# EAGLE design MLX90614-IR v4 (EAGLE 6.6.0)
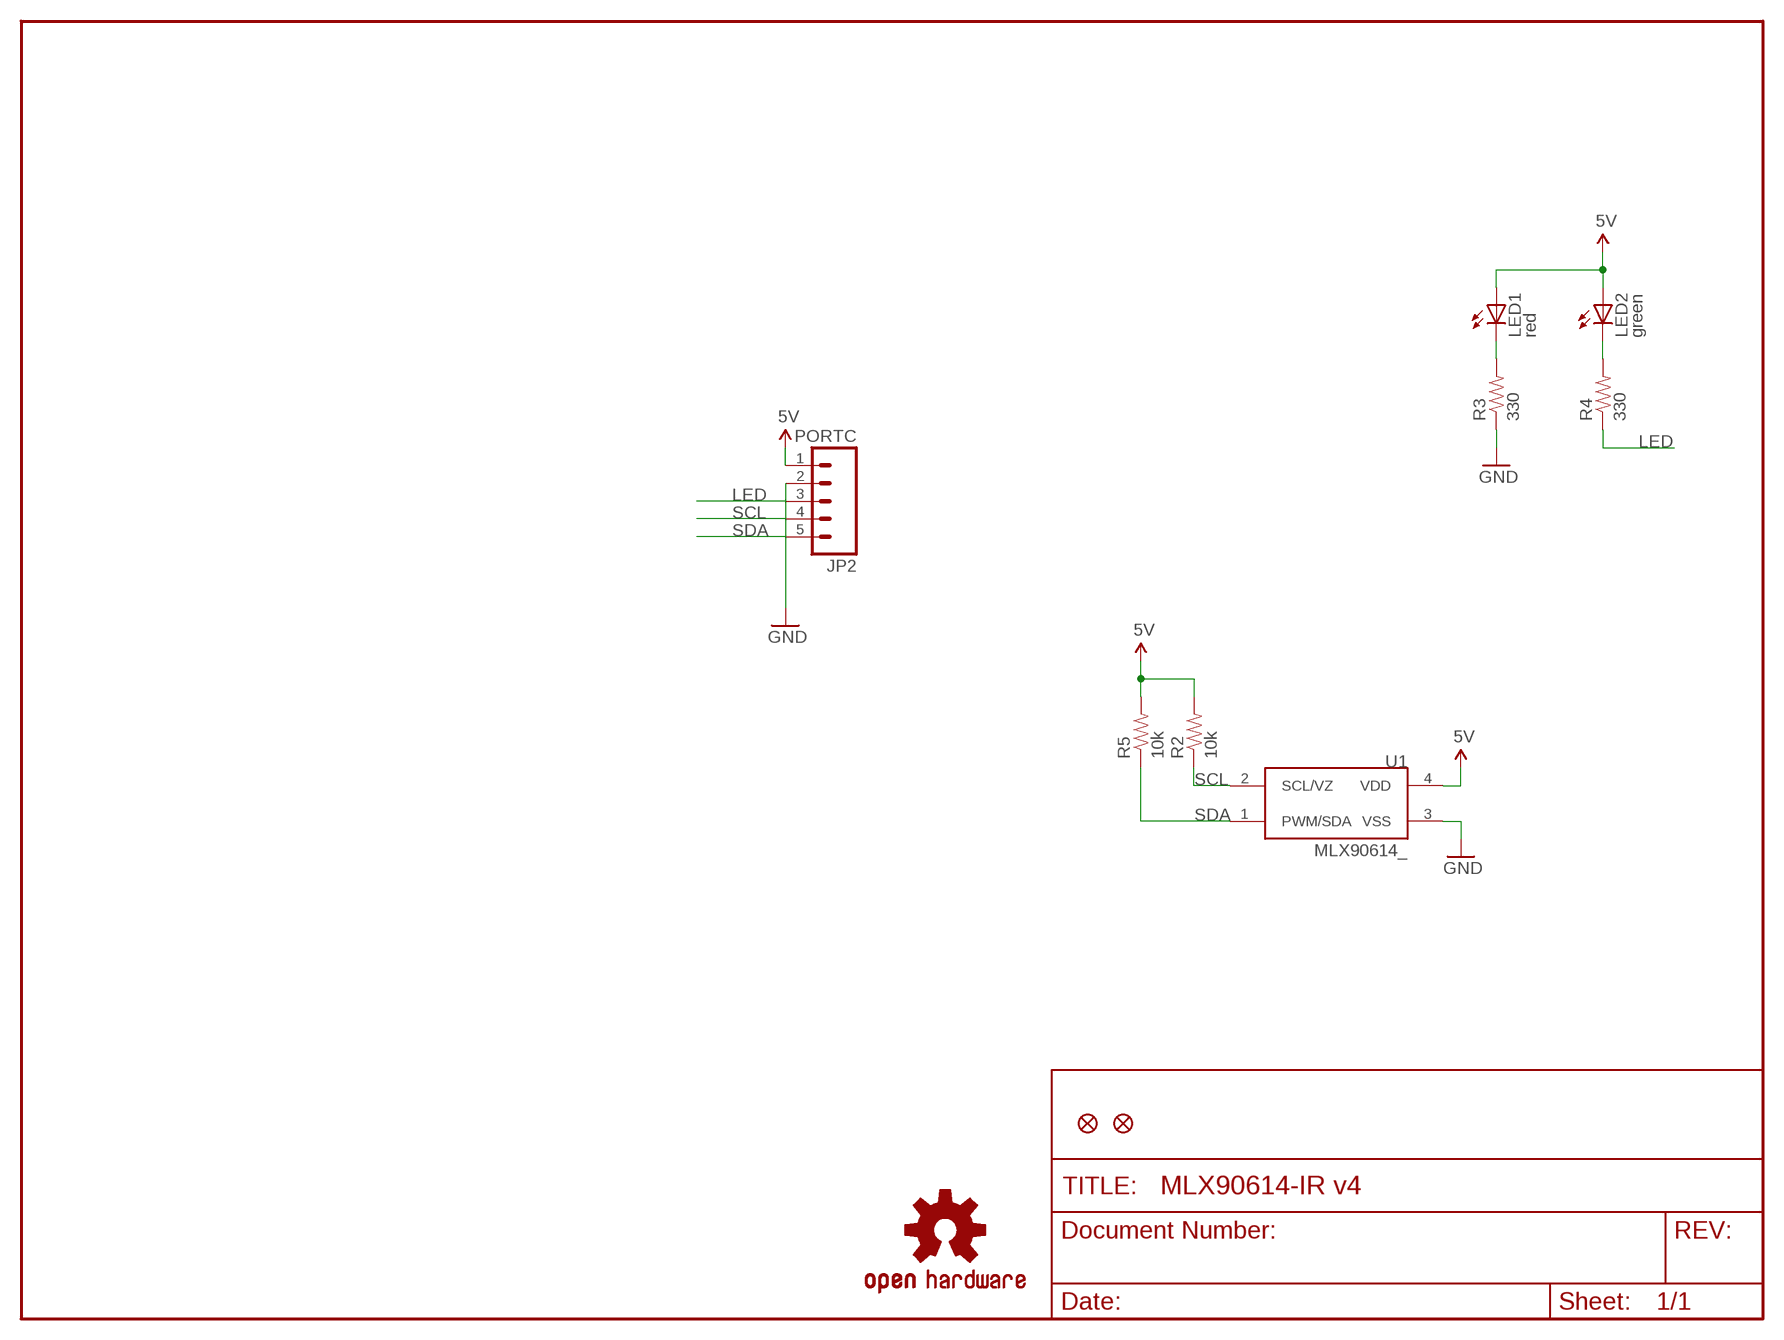
[diagram p0: schematic, sheet 1]

## Parts
JP2  PORTC  M05PTH  [1X05]
JP3  FIDUCIAL1X2.5  [FIDUCIAL-1X2.5]
JP5  FIDUCIAL1X2.5  [FIDUCIAL-1X2.5]
LED1  red  LED0603  [LED-0603]
LED2  green  LED0603  [LED-0603]
R2  10k  RESISTOR0402-RES  [0402-RES]
R3  330  RESISTOR0402-RES  [0402-RES]
R4  330  RESISTOR0402-RES  [0402-RES]
R5  10k  RESISTOR0402-RES  [0402-RES]
U1  MLX90614_  [TO-39]
U$1  OSHW-LOGOS  [OSHW-LOGO-S]

## Nets
5V: JP2.1 LED1.A LED2.A R2.2 R5.2 U1.4(VDD)
GND: JP2.2 R3.1 U1.3(VSS)
LED: JP2.3 R4.1
N$2: LED1.C R3.2
N$3: LED2.C R4.2
SCL: JP2.4 R2.1 U1.2(SCL/VZ)
SDA: JP2.5 R5.1 U1.1(PWM/SDA)

## Library data of the parts
JP2 = SparkFun-Connectors:M05: Header 5 Standard 5-pin 0.1" header. Use with straight break away headers (SKU : PRT-00116), right angle break away headers (PRT-00553), swiss pins (PRT-00743), machine pins (PRT-00117), and female headers (PRT-00115). Molex polarized connector foot print use with SKU : PRT-08230 with associated crimp pins and housings.
JP3 JP5 = abes:FIDUCIAL: Fiducial Alignment Points Various fiducial points for machine vision alignment.
LED1 LED2 = SparkFun:LED: LEDs Standard schematic elements and footprints for 5mm, 3mm, 1206, and 0603 sized LEDs. 5mm - Spark Fun Electronics SKU : COM-00529 (and others)
R2-R5 = SparkFun:RESISTOR: Resistor Basic schematic elements and footprints for 0603, 1206, and PTH 1/10th watt (small) resistors.
U1 = SparkFun-Sensors:MLX90614: Non-contact PIR I2C interface temperature sensor
U$1 = SparkFun:OSHW-LOGO: Open Source Hardware Logo This logo indicates the piece of hardware it is found on incorporates a OSHW license and/or adheres to the definition of open source hardware found here: http://freedomdefined.org/OSHW

## Net classes
0 default: width 0.406 mm, clearance 0.406 mm

## Board
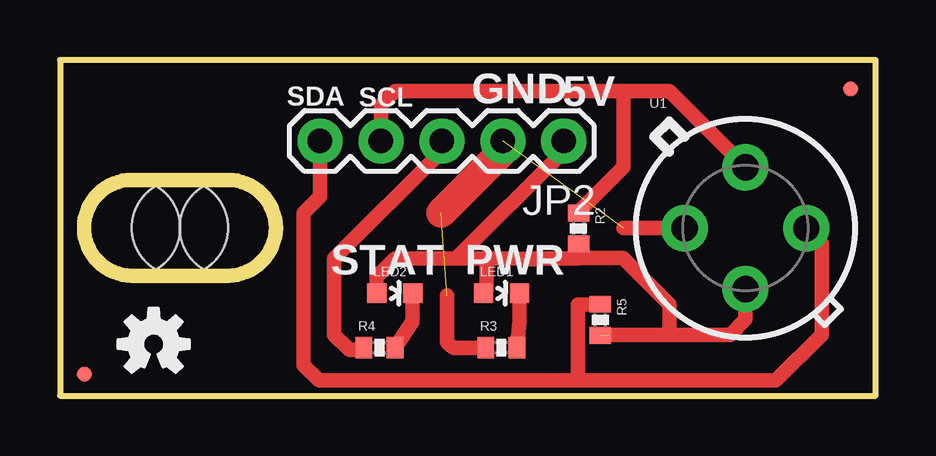
[diagram p1: board, top side]

Size 34 x 14 mm. Coordinates in mm from the lower left corner, seen from the top.
Outline: 0,0 34,0 34,14 0,14 0,0
Copper layers (1*16): Top 0.035mm / dielectric 1.5mm / Bottom 0.035mm
Design rules "SparkFun": minimum track width 8mil, minimum drill 20mil, track to track 8mil, track to pad 8mil, pad to pad 8mil, via to via 8mil, smd to smd 8mil, copper to edge 8mil, drill to drill 8mil, minimum pad ring 12mil, minimum via ring 10mil, stop-mask expansion 4mil, vias tented up to drill 20mil, thermal gap 10mil
Holes 4 mm at 5,7 7,7 3,7
Milling: 4 lines

### Footprints (pad centres in the part's own frame; a part is rotated, then mirrored left to right if it is on the bottom)
1X05 = drill 1.016 pad 1.88: 1 0,0; 2 2.54,0; 3 5.08,0; 4 7.62,0; 5 10.16,0
FIDUCIAL-1X2.5 = smd 0.635 x 0.635: 1 0,0
LED-0603 = smd 0.8 x 0.8: A 0,-0.75; C 0,0.75
0402-RES = smd 0.7 x 0.9: 1 -0.65,0; 2 0.65,0
TO-39 = drill 1.1 pad 1.93: 1 2.54,0; 2 0,2.54; 3 -2.54,0; 4 0,-2.54

### Placement (x,y rotation side)
JP2  21,10.62 180 top
JP3  1.02,0.9 0 top
JP5  32.96,12.8 0 top
LED1  18.4,4.27 270 top
LED2  13.96,4.27 270 top
R2  21.62,6.97 270 top
R3  18.4,2 0 top
R4  13.32,2 0 top
R5  22.52,3.16 270 top
U1  28.57,6.99 0 top
U$1  3.91,2.14 0 top

### Tracks (layer width: path | path; a pad name or v marks a point on that pad's centre or on a via)
5V  (1 unrouted)
  Top 0.406: 17.78,4.4 LED1.A | JP2.1 21,10.21
  Top 0.61: LED2.A 13.21,4.95 13.97,5.71 16.51,5.71 | 16.51,5.71 17.78,5.71 | 17.78,5.71 19.05,5.71 19.71,5.68 19.75,5.71 21.59,5.71 21.62,5.75 | 25.4,2.54 25.4,3.81 23.46,5.75 21.62,5.75 | 25.4,2.54 22.92,2.54 | 17.78,4.4 17.78,5.71 | 21,10.21 16.51,5.71 | U1.4 28.57,3.17 27.94,2.54 25.4,2.54 | R2.2 21.62,5.75
GND  (2 unrouted)
  Top 0.61: JP2.2 18.46,10.21 | R3.1 16.41,2 16.14,2.22 16.14,4.18 | U1.3 23.5,6.99
  Top 1.219: 18.46,10.21 15.88,7.62
LED
  Top 0.61: JP2.3 15.92,10.21 11.43,5.71 11.43,2.54 12.06,1.91 12.57,1.91 R4.1
N$2
  Top 0.61: LED1.C 19.15,3.1 R3.2
N$3
  Top 0.61: LED2.C 14.71,3.1 R4.2
SCL
  Top 0.61: JP2.4 13.38,12.11 13.97,12.7 23.5,12.7 | 23.5,12.7 25.4,12.7 U1.2 | R2.1 21.62,7.65 23.5,9.53 23.5,12.7
SDA
  Top 0.61: JP2.5 10.84,8.3 10.16,7.62 10.16,1.27 10.79,0.64 21.59,0.64 | 21.59,0.64 29.84,0.64 31.75,2.54 31.75,6.35 U1.1 | R5.1 21.59,3.81 21.59,0.64

### Text on the board
tPlace: SDA | SCL | GND | 5V | STAT | PWR